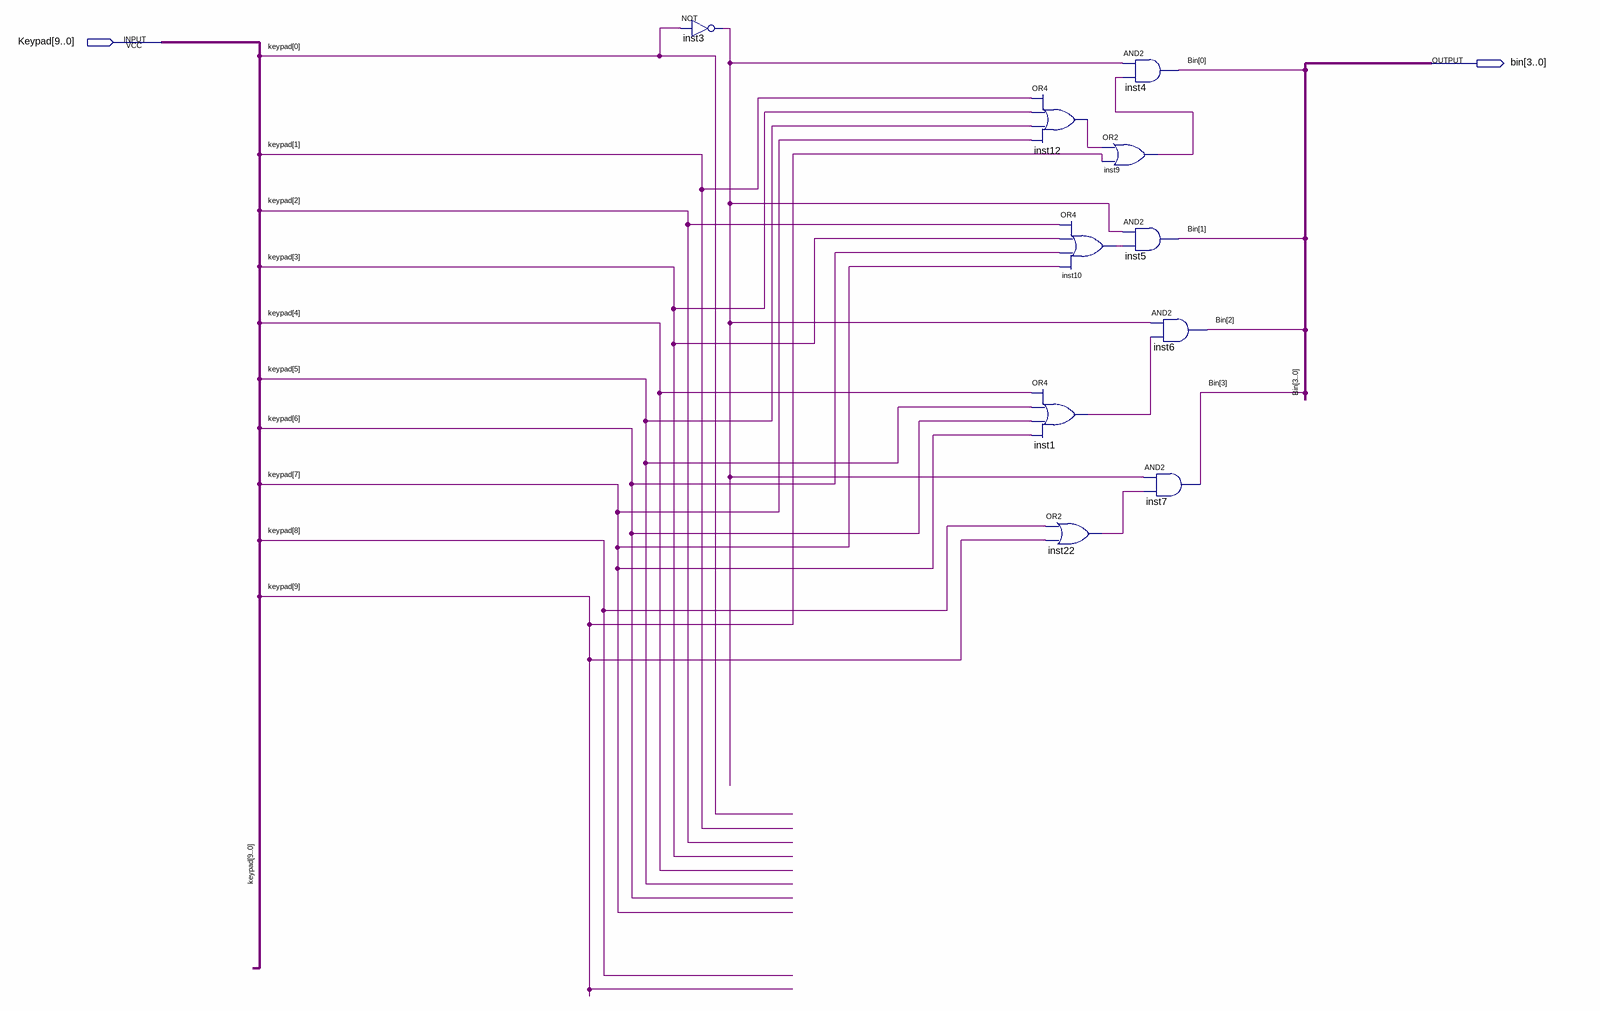
[diagram p0: schematic sheet]
// Quartus schematic Decimal_to_binary.bdf as structural Verilog: 10 symbols, 2 pins
module Decimal_to_binary (
  input  [9:0] Keypad,
  output [3:0] bin
);

  wire inst1_out, inst3_out, inst9_out, inst10_out, inst12_out, inst22_out;

  not inst3 (inst3_out, Keypad[0]);
  or inst12 (inst12_out, Keypad[1], Keypad[3], Keypad[5], Keypad[7]);
  or inst10 (inst10_out, Keypad[2], Keypad[3], Keypad[6], Keypad[7]);
  or inst1 (inst1_out, Keypad[4], Keypad[5], Keypad[6], Keypad[7]);
  or inst22 (inst22_out, Keypad[8], Keypad[9]);
  and inst4 (bin[0], inst3_out, inst9_out);
  or inst9 (inst9_out, inst12_out, Keypad[9]);
  and inst5 (bin[1], inst3_out, inst10_out);
  and inst6 (bin[2], inst3_out, inst1_out);
  and inst7 (bin[3], inst3_out, inst22_out);
endmodule
